# EAGLE design Daughter_ESCON (EAGLE 8.6.0)
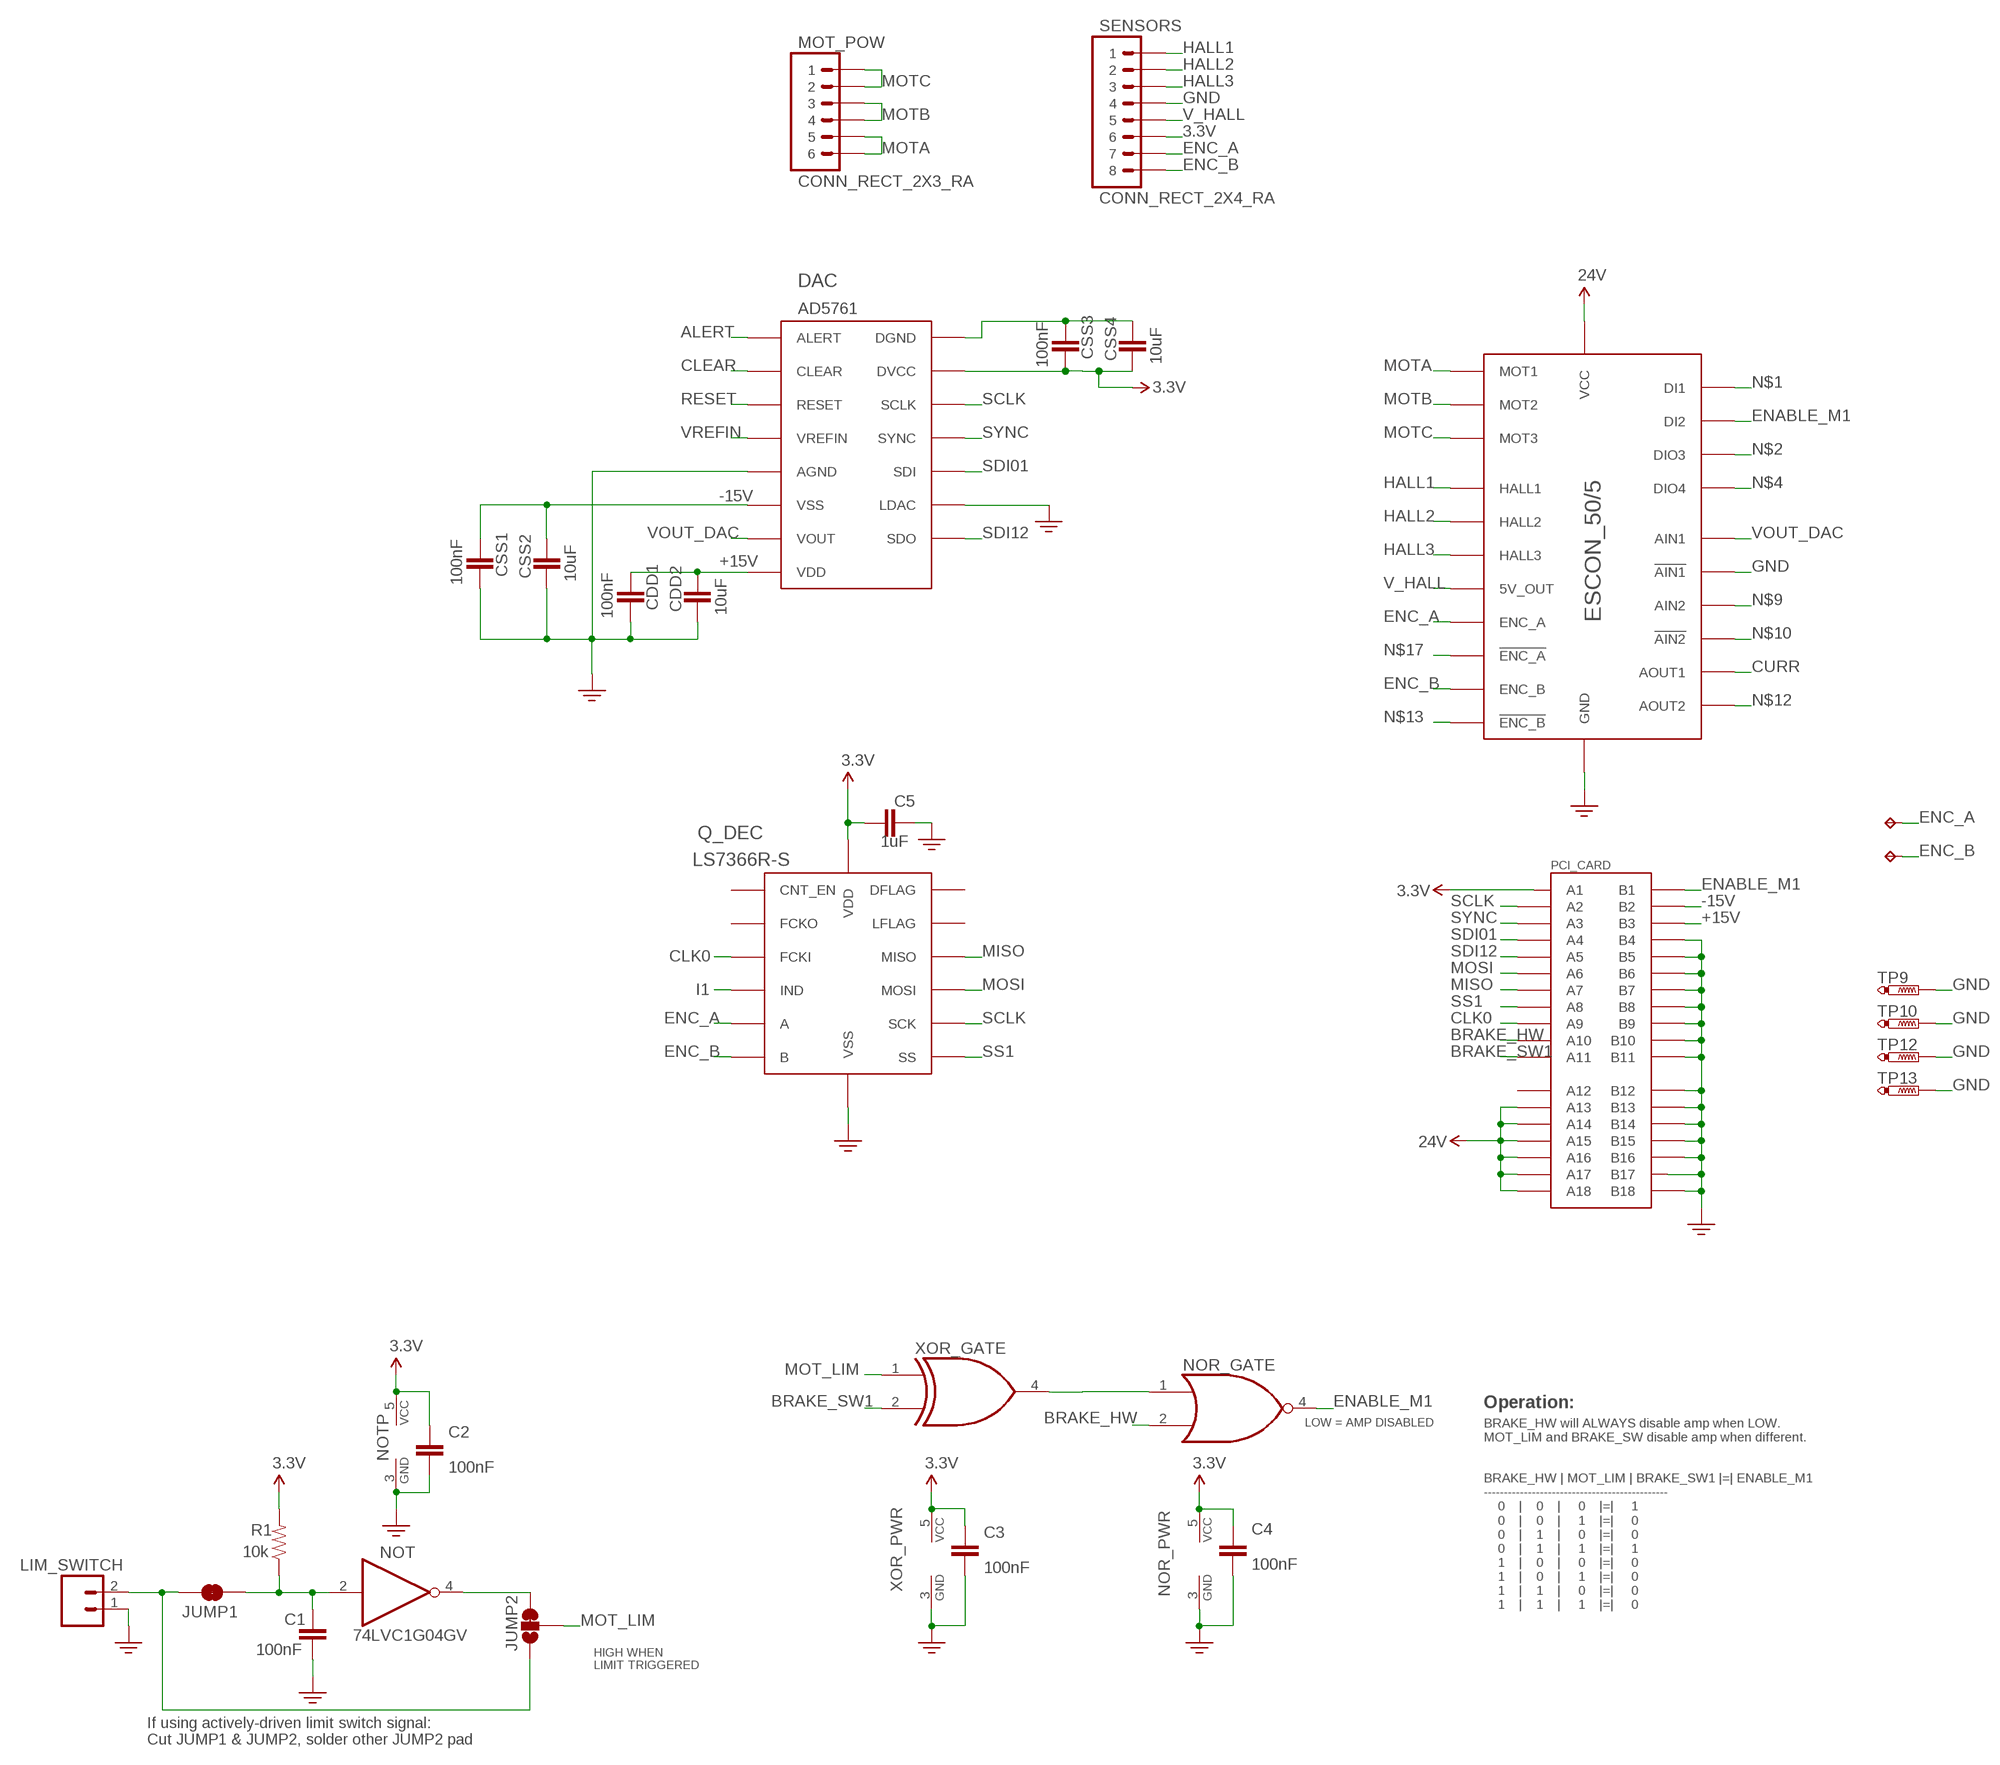
[diagram p0: schematic, sheet 1]

## Parts
A  TEST_POINT_0805  [0805-TP]
B  TEST_POINT_0805  [0805-TP]
C1  100nF  CAP0603-CAP  [0603-CAP]
C2  100nF  CAP0603-CAP  [0603-CAP]
C3  100nF  CAP0603-CAP  [0603-CAP]
C4  100nF  CAP0603-CAP  [0603-CAP]
C5  1uF  CAP0603-CAP  [0603-CAP]
CDD1  100nF  CAP0603-CAP  [0603-CAP]
CDD2  10uF  CAP0805  [C0805K]
CSS1  100nF  CAP0603-CAP  [0603-CAP]
CSS2  10uF  CAP0805  [C0805K]
CSS3  100nF  CAP0603-CAP  [0603-CAP]
CSS4  10uF  CAP0805  [C0805K]
DAC  AD5761  [TSSOP16]
ESCON_50/5  ESCON_50-5  [ESCON_50-5]
JUMP1  JUMPER-PAD-2-NC_BY_TRACE  [PAD-JUMPER-2-NC_BY_TRACE_YES_SILK]
JUMP2  JUMPER-PAD-3-2OF3_NC_BY_TRACE  [PAD-JUMPER-3-2OF3_NC_BY_TRACE_YES_SILK_FULL_BOX]
LIM_SWITCH  22-05-7028-02  [7395-02]
MOT_POW  CONN_RECT_2X3_RA  [2X3-RA]
NOR  NOR-SOT353  [SOT353]
NOT  74LVC1G04GV  74LVC1G04DBV  [SOT23-5]
PCI_CARD  PCIE-36-EDGE  [PCIE-36-EDGE]
Q_DEC  LS7366R-S  [SOIC-14]
R1  10k  RESISTOR-0603  [0603-RES]
SENSORS  CONN_RECT_2X4_RA  [2X4-RA]
TP9  PTR1TP20R  [TP20R]
TP10  PTR1TP20R  [TP20R]
TP12  PTR1TP20R  [TP20R]
TP13  PTR1TP20R  [TP20R]
XOR  XOR-SOT353  [SOT353]

## Nets
3.3V: C2.1 C3.1 C4.1 C5.1 CSS3.2 CSS4.2 DAC.15(DVCC) NOR.5(_PWR:VCC) NOT.5(VCC) PCI_CARD.A1 Q_DEC.14(VDD) R1.2 SENSORS.6 XOR.5(_PWR:VCC)
24V: ESCON_50/5.P$7(VCC) ESCON_50/5.P$8(VCC) PCI_CARD.A13 PCI_CARD.A14 PCI_CARD.A15 PCI_CARD.A16 PCI_CARD.A17 PCI_CARD.A18
+15V: CDD1.1 CDD2.1 DAC.8(VDD) PCI_CARD.B3
-15V: CSS1.1 CSS2.1 DAC.6(VSS) PCI_CARD.B2
ALERT: DAC.1(ALERT)
BRAKE_HW: NOR.2(_GATE:B) PCI_CARD.A10
BRAKE_SW1: PCI_CARD.A11 XOR.2(_GATE:B)
CLEAR: DAC.2(CLEAR)
CLK0: PCI_CARD.A9 Q_DEC.2(FCKI)
CURR: ESCON_50/5.P$25(AOUT1)
ENABLE_M1: ESCON_50/5.P$21(DI2) NOR.4(_GATE:Y) PCI_CARD.B1
ENC_A: A.1(TP) ESCON_50/5.P$12(ENC_A) Q_DEC.12(A) SENSORS.7
ENC_B: B.1(TP) ESCON_50/5.P$16(ENC_B) Q_DEC.11(B) SENSORS.8
GND: C1.2 C2.2 C3.2 C4.2 C5.2 CDD1.2 CDD2.2 CSS1.2 CSS2.2 CSS3.1 CSS4.1 DAC.5(AGND) DAC.11(LDAC) DAC.16(DGND) ESCON_50/5.P$9(GND) ESCON_50/5.P$10(GND) ESCON_50/5.P$23(GND) ESCON_50/5.P$28(!AIN1) LIM_SWITCH.1 NOR.3(_PWR:GND) NOT.3(GND) PCI_CARD.B4 PCI_CARD.B5 PCI_CARD.B6 PCI_CARD.B7 PCI_CARD.B8 PCI_CARD.B9 PCI_CARD.B10 PCI_CARD.B11 PCI_CARD.B12 PCI_CARD.B13 PCI_CARD.B14 PCI_CARD.B15 PCI_CARD.B16 PCI_CARD.B17 PCI_CARD.B18 Q_DEC.3(VSS) SENSORS.4 TP9.TP TP10.TP TP12.TP TP13.TP XOR.3(_PWR:GND) ; supply symbol labelled GND2
HALL1: ESCON_50/5.P$13(HALL1) SENSORS.1
HALL2: ESCON_50/5.P$15(HALL2) SENSORS.2
HALL3: ESCON_50/5.P$17(HALL3) SENSORS.3
I1: Q_DEC.10(IND)
MISO: PCI_CARD.A7 Q_DEC.6(MISO)
MOSI: PCI_CARD.A6 Q_DEC.7(MOSI)
MOT_LIM: JUMP2.2 XOR.1(_GATE:A)
MOTA: ESCON_50/5.P$1(MOT1) ESCON_50/5.P$2(MOT1) MOT_POW.5 MOT_POW.6
MOTB: ESCON_50/5.P$3(MOT2) ESCON_50/5.P$4(MOT2) MOT_POW.3 MOT_POW.4
MOTC: ESCON_50/5.P$5(MOT3) ESCON_50/5.P$6(MOT3) MOT_POW.1 MOT_POW.2
N$1: ESCON_50/5.P$22(DI1)
N$2: ESCON_50/5.P$20(DIO3)
N$3: JUMP1.1 JUMP2.1 LIM_SWITCH.2
N$4: ESCON_50/5.P$19(DIO4)
N$5: C1.1 JUMP1.2 NOT.2(I) R1.1
N$6: JUMP2.3 NOT.4(O)
N$9: ESCON_50/5.P$27(AIN2)
N$10: ESCON_50/5.P$26(!AIN2)
N$12: ESCON_50/5.P$24(AOUT2)
N$13: ESCON_50/5.P$18(!ENC_B)
N$14: NOR.1(_GATE:A) XOR.4(_GATE:Y)
N$17: ESCON_50/5.P$14(!ENC_A)
RESET: DAC.3(RESET)
SCLK: DAC.14(SCLK) PCI_CARD.A2 Q_DEC.5(SCK)
SDI01: DAC.12(SDI) PCI_CARD.A4
SDI12: DAC.10(SDO) PCI_CARD.A5
SS1: PCI_CARD.A8 Q_DEC.4(SS)
SYNC: DAC.13(SYNC) PCI_CARD.A3
V_HALL: ESCON_50/5.P$11(5V_OUT) SENSORS.5
VOUT_DAC: DAC.7(VOUT) ESCON_50/5.P$29(AIN1)
VREFIN: DAC.4(VREFIN)
Unconnected: PCI_CARD.A12 Q_DEC.1(FCKO) Q_DEC.8(LFLAG) Q_DEC.9(DFLAG) Q_DEC.13(CNT_EN)

## Notes on the sheet
- Operation:
- LOW = AMP DISABLED
- BRAKE_HW will ALWAYS disable amp when LOW.
  MOT_LIM and BRAKE_SW disable amp when different.
- BRAKE_HW | MOT_LIM | BRAKE_SW1 |=| ENABLE_M1
  ----------------------------------------------
      0    |    0    |     0    |=|     1
      0    |    0    |     1    |=|     0
      0    |    1    |     0    |=|     0
      0    |    1    |     1    |=|     1
      1    |    0    |     0    |=|     0
      1    |    0    |     1    |=|     0
      1    |    1    |     0    |=|     0
      1    |    1    |     1    |=|     0
- HIGH WHEN
  LIMIT TRIGGERED
- If using actively-driven limit switch signal:
  Cut JUMP1 & JUMP2, solder other JUMP2 pad

## Library data of the parts
A B = Cannula_1_0:TEST_POINT
C1-C5 CDD1 CSS1 CSS3 = SparkFun-Capacitors:CAP: Capacitor Standard 0603 ceramic capacitor, and 0.1" leaded capacitor.
CDD2 CSS2 CSS4 = Cannula_1_0:CAP0805
DAC = Cannula_1_0:AD5761: AD5761R Multiple Range, 16-bit, Bipolar/Unipolar Voltage Output DAC datasheet <http://www.analog.com/media/en/technical-documentation/data-sheets/AD5761R_5721R.pdf> Trevor Bruns- 2015
ESCON_50/5 = Cannula_1_0:ESCON_50-5
JUMP1 = SparkFun-Passives:JUMPER-PAD-2-NC_BY_TRACE
JUMP2 = SparkFun-Passives:JUMPER-PAD-3-2OF3_NC_BY_TRACE
LIM_SWITCH = Cannula_1_0:22-?-02: CONNECTOR wire to board 2.54 mm (.1 inch) pitch header; OC_FARNELL: 9731601; OC_NEWARK: unknown
MOT_POW = Cannula_1_0:CONN_RECT_2X3
NOR = Cannula_1_0:NOR: Single 2-Input NOR Gate Digikey: 74AHC1G02SE-7DICT-ND Datasheet <http://www.diodes.com/datasheets/74AHC1G02.pdf> Trevor Bruns 6/1/2015
NOT = 74xx-little-us:74*1G04: INVERTER Gate
PCI_CARD = Cannula_1_0:PCIE-36-*: PCI-E 36-way connectors
Q_DEC = Cannula_1_0:LS7366R: LS7366R 32-Bit Quadrature Counter with SPI datasheet <http://www.lsicsi.com/pdfs/Data_Sheets/LS7366R.pdf> Trevor Bruns- 2015
R1 = Cannula_1_0:RESISTOR
SENSORS = Cannula_1_0:CONN_RECT_2X4
TP9 TP10 TP12 TP13 = testpad:PTR1: TEST PIN
XOR = Cannula_1_0:XOR

## Board
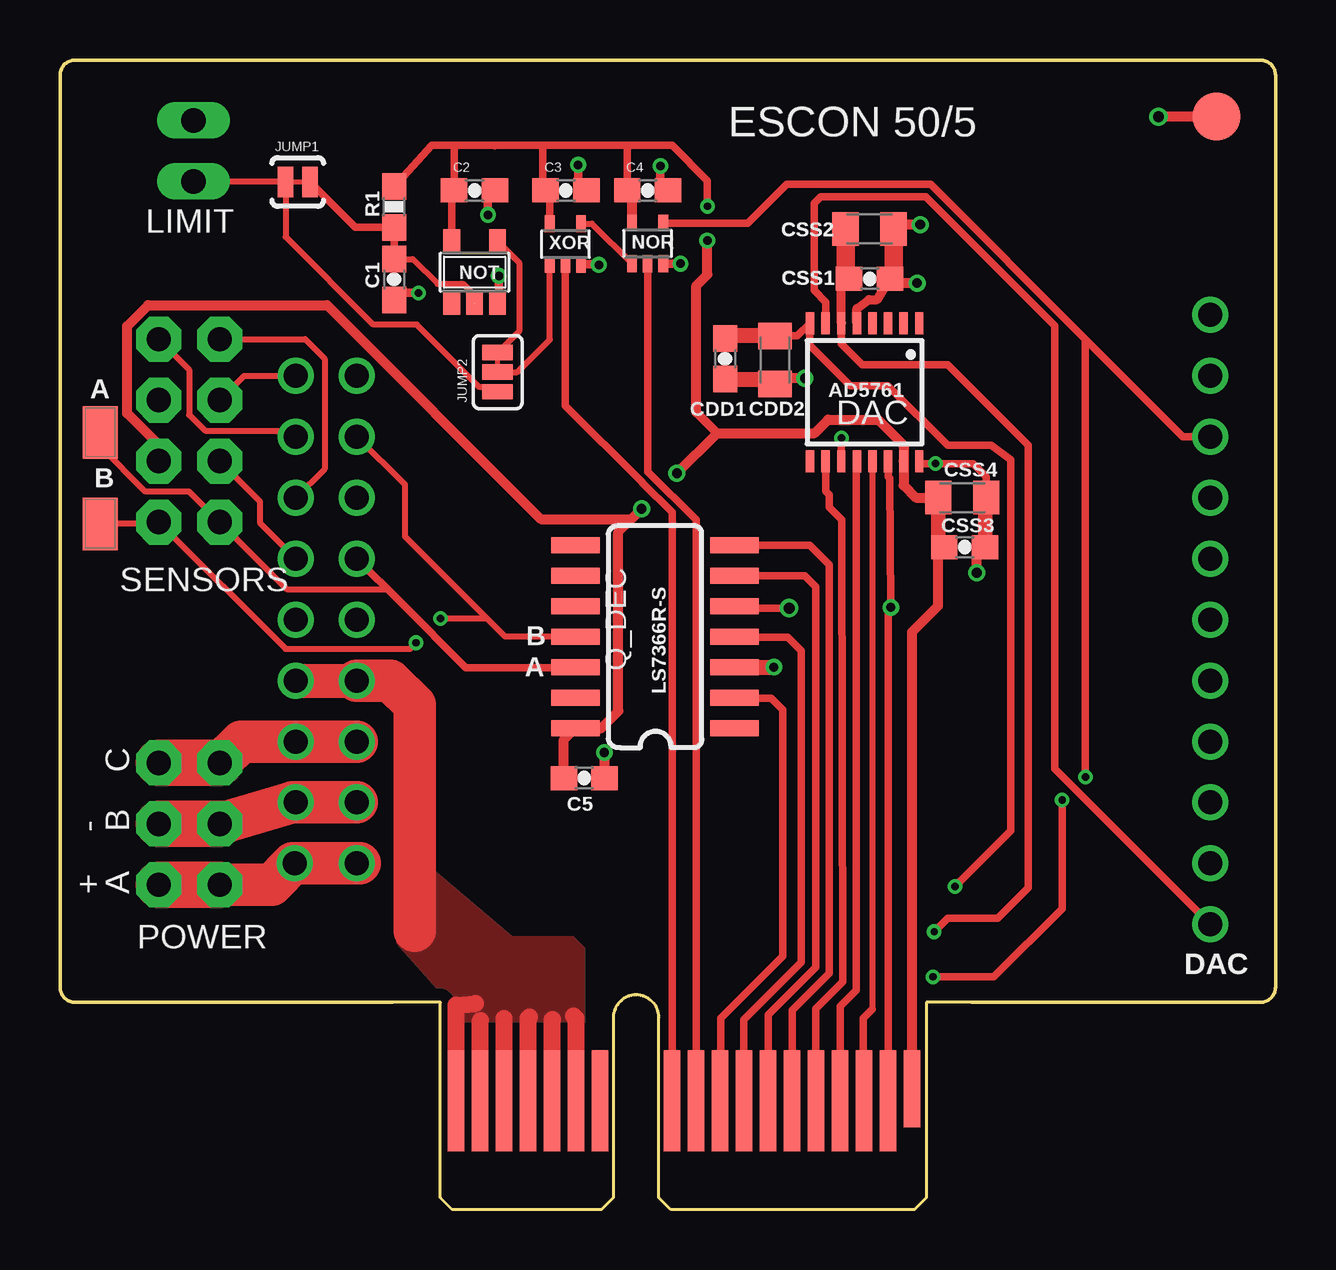
[diagram p1: board, top side]
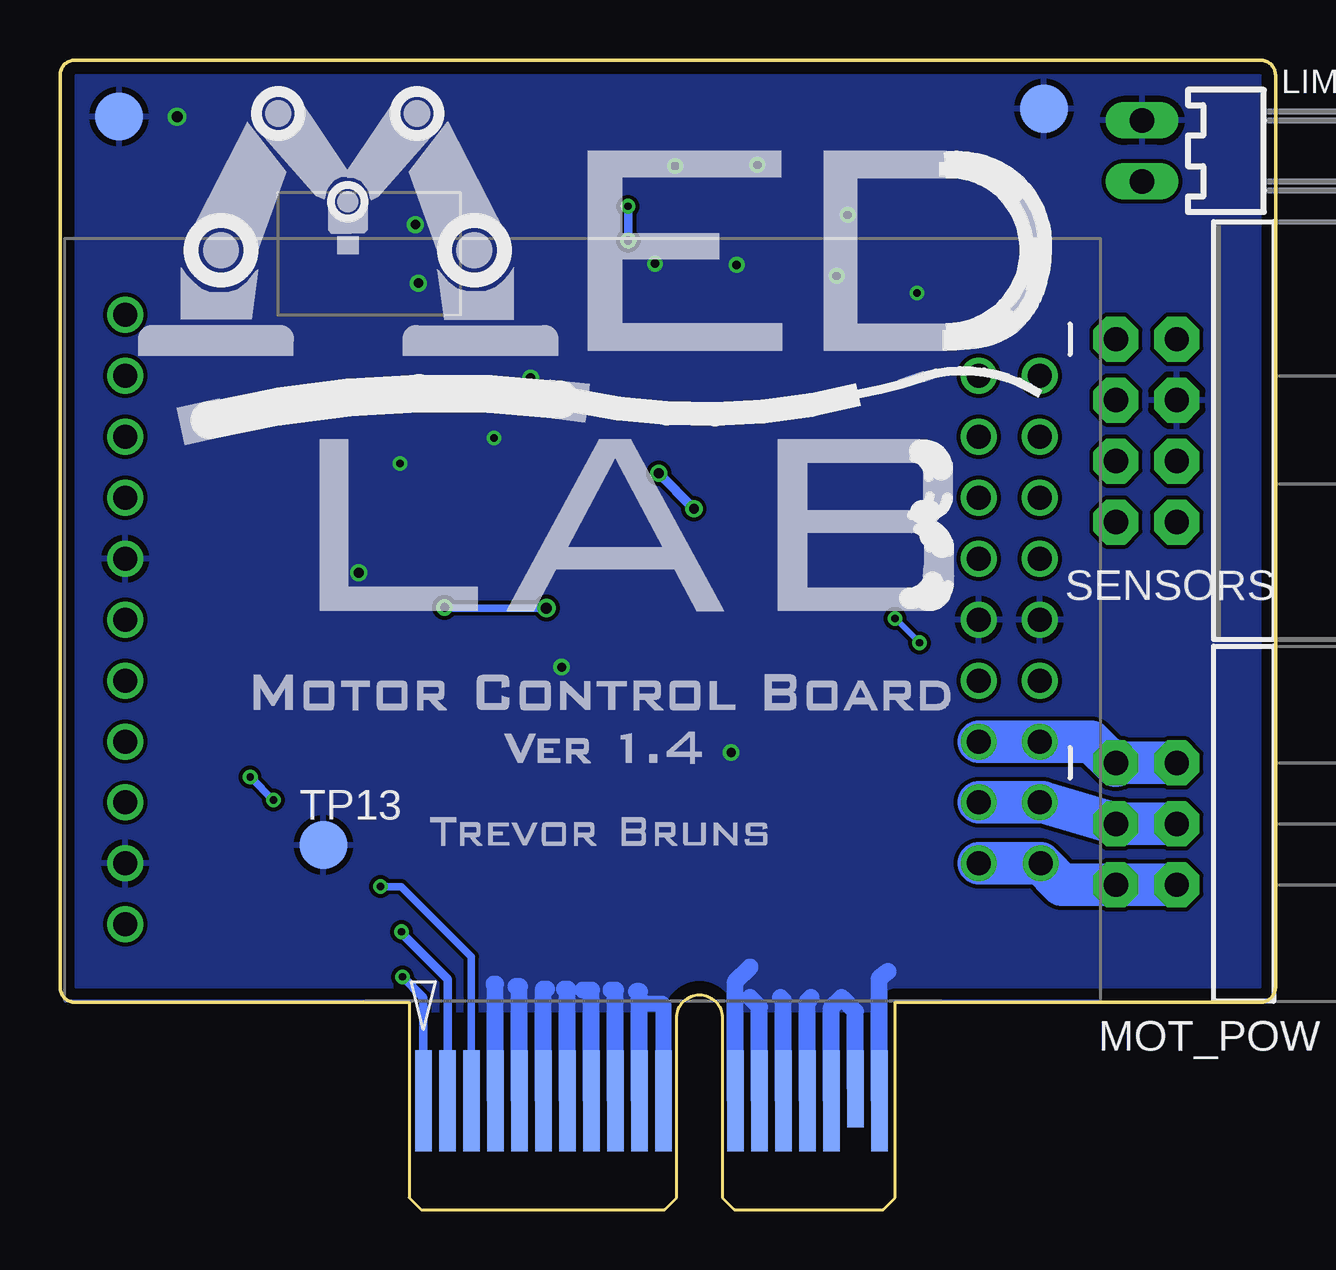
[diagram p2: board, bottom side, seen from below]

Size 50.65 x 47.9 mm. Coordinates in mm from the lower left corner, seen from the top.
Outline: 13.87,8.64 0.63,8.64 arc-90 0,9.27 0,47.27 arc-90 0.63,47.9 50.01,47.9 arc-90 50.65,47.27 50.65,9.27 arc-90 50.01,8.64 38,8.64
Copper layers (1*16): Top 0.035mm / dielectric 1.5mm / Bottom 0.035mm
Design rules "PCBWay_2018-01-18": minimum track width 6mil, minimum drill 12mil, track to track 6.5mil, track to pad 6.5mil, pad to pad 6.5mil, via to via 6.5mil, smd to smd 6mil, copper to edge 20mil, drill to drill 8mil, minimum pad ring 6mil, minimum via ring 6mil, stop-mask expansion 4mil, vias tented up to drill 0mil, thermal gap 10mil

### Footprints (pad centres in the part's own frame; a part is rotated, then mirrored left to right if it is on the bottom)
0805-TP = smd 2.2 x 1.45: 1 0,0
0603-CAP = smd 1.1 x 1: 1 -0.85,0; 2 0.85,0
C0805K = smd 1.1 x 1.4: 1 -1,0; 2 1,0
TSSOP16 = smd 0.9 x 0.35: 1 -2.875,2.275; 2 -2.875,1.625; 3 -2.875,0.975; 4 -2.875,0.325; 5 -2.875,-0.325; 6 -2.875,-0.975; 7 -2.875,-1.625; 8 -2.875,-2.275; 9 2.875,-2.275; 10 2.875,-1.625; 11 2.875,-0.975; 12 2.875,-0.325; 13 2.875,0.325; 14 2.875,0.975; 15 2.875,1.625; 16 2.875,2.275
ESCON_50-5 = drill 1: P$1 -19.09,10.16; P$2 -16.51,10.16; P$3 -19.05,7.62; P$4 -16.51,7.62; P$5 -19.05,5.08; P$6 -16.51,5.08; P$7 -19.05,2.54; P$8 -16.51,2.54; P$9 -19.05,0; P$10 -16.51,0; P$11 -19.05,-2.54; P$12 -16.51,-2.54; P$13 -19.05,-5.08; P$14 -16.51,-5.08; P$15 -19.05,-7.62; P$16 -16.51,-7.62; P$17 -19.05,-10.16; P$18 -16.51,-10.16; P$19 19.05,-12.7; P$20 19.05,-10.16; P$21 19.05,-7.62; P$22 19.05,-5.08; P$23 19.05,-2.54; P$24 19.05,0; P$25 19.05,2.54; P$26 19.05,5.08; P$27 19.05,7.62; P$28 19.05,10.16; P$29 19.05,12.7
PAD-JUMPER-2-NC_BY_TRACE_YES_SILK = smd 0.635 x 1.27: 1 -0.508,0; 2 0.508,0
PAD-JUMPER-3-2OF3_NC_BY_TRACE_YES_SILK_FULL_BOX = smd 0.635 x 1.27: 1 -0.813,0; 2 0,0; 3 0.813,0
7395-02 = drill 1.016 long: 1 1.27,0; 2 -1.27,0
2X3-RA = drill 1.016 pad 1.88 octagon: 1 -1.27,2.54; 2 1.27,2.54; 3 -1.27,0; 4 1.27,0; 5 -1.27,-2.54; 6 1.27,-2.54
SOT353 = smd 0.4 x 0.7: 1 -0.65,-0.85; 2 0,-0.85; 3 0.65,-0.85; 4 0.65,0.85; 5 -0.65,0.85
SOT23-5 = smd 0.69 x 0.99: 1 -0.95,-1.29; 2 0,-1.29; 3 0.95,-1.29; 4 0.95,1.3; 5 -0.95,1.3
PCIE-36-EDGE = smd 0.7 x 3.2 bottom: A1 -11.5,-3.6 | smd 0.7 x 4.2 bottom: A2 -10.5,-4.1; A3 -9.5,-4.1; A4 -8.5,-4.1; A5 -7.5,-4.1; A6 -6.5,-4.1; A7 -5.5,-4.1; A8 -4.5,-4.1; A9 -3.5,-4.1; A10 -2.5,-4.1; A11 -1.5,-4.1; A12 1.5,-4.1; A13 2.5,-4.1; A14 3.5,-4.1; A15 4.5,-4.1; A16 5.5,-4.1; A17 6.5,-4.1; A18 7.5,-4.1 | smd 0.7 x 4.2: B1 -11.5,-4.1; B2 -10.5,-4.1; B3 -9.5,-4.1; B4 -8.5,-4.1; B5 -7.5,-4.1; B6 -6.5,-4.1; B7 -5.5,-4.1; B8 -4.5,-4.1; B9 -3.5,-4.1; B10 -2.5,-4.1; B11 -1.5,-4.1; B12 1.5,-4.1; B13 2.5,-4.1; B14 3.5,-4.1; B15 4.5,-4.1; B16 5.5,-4.1; B18 7.5,-4.1 | smd 0.7 x 3.2: B17 6.5,-3.6
SOIC-14 = smd 0.66 x 2.032: 1 -4.445,-3.315; 2 -3.175,-3.315; 3 -1.905,-3.315; 4 -0.635,-3.315; 5 0.635,-3.315; 6 1.905,-3.315; 7 3.175,-3.315; 8 3.175,3.315; 9 1.905,3.315; 10 0.635,3.315; 11 -0.635,3.315; 12 -1.905,3.315; 13 -3.175,3.315; 14 -4.445,3.315
0603-RES = smd 1.1 x 1: 1 -0.85,0; 2 0.85,0
2X4-RA = drill 1.016 pad 1.88 octagon: 1 -1.27,3.81; 2 1.27,3.81; 3 -1.27,1.27; 4 1.27,1.27; 5 -1.27,-1.27; 6 1.27,-1.27; 7 -1.27,-3.81; 8 1.27,-3.81
TP20R = smd 2 x 2: TP 0,0

### Placement (x,y rotation side)
A  1.68,32.38 90 top
B  1.68,28.57 90 top
C1  13.92,38.76 270 top
C2  17.27,42.47 0 top
C3  21.08,42.47 0 top
C4  24.49,42.47 0 top
C5  21.84,17.98 0 top
CDD1  27.71,35.46 270 top
CDD2  29.79,35.41 270 top
CSS1  33.73,38.78 0 top
CSS2  33.73,40.87 0 top
CSS3  37.69,27.61 180 top
CSS4  37.59,29.67 180 top
DAC  33.53,34.06 270 top
ESCON_50/5  28.88,24.59 180 bottom
JUMP1  9.91,42.82 0 top
JUMP2  18.24,34.9 90 top
LIM_SWITCH  5.56,44.12 90 bottom
MOT_POW  5.38,16.08 0 bottom
NOR  24.49,40.26 0 top
NOT  17.27,39.06 0 top
PCI_CARD  24,8.63 0 bottom
Q_DEC  24.79,24.51 90 top
R1  13.92,41.78 90 top
SENSORS  5.38,32.46 0 bottom
TP9  9.65,45.87 0 bottom
TP10  48.18,45.54 0 top
TP12  48.18,45.54 0 bottom
TP13  39.67,15.19 0 bottom
U$2  [LOGO_MOTOR_CONTROL_1.4_SMALL]  27.79,18.95 0 bottom
U$6  LOGO_MEDLAB_1.5X0.86  [LOGO_MEDLAB_1.5X0.86]  27.38,34.49 0 bottom
XOR  21.06,40.23 0 top

### Tracks (layer width: path | path; a pad name or v marks a point on that pad's centre or on a via)
3.3V  (via drill 0.3, 0.36, 0.41)
  Top 0.305: XOR.5 20.41,42.29 C3.1 20.12,42.58 20.12,44.35 | 23.62,44.35 20.12,44.35 | C4.1 23.64,44.33 23.62,44.35 | 20.12,44.35 18.14,44.35 | 18.14,44.35 16.41,44.35 | 16.41,44.35 15.48,44.35 R1.2 | 18.12,44.33 18.14,44.35 | 16.41,44.35 16.42,44.33 C2.1 16.32,42.37 NOT.5 | 23.62,44.35 25.5,44.35 26.97,42.87 v26.97,41.81
  Top 0.356: 27.38,32.36 26.52,33.22
  Top 0.406: 23.8,28.78 23.27,28.24 23.27,20.78 22.55,20.07 Q_DEC.14 20.99,19.58 C5.1 | 23.8,28.78 v24.23,29.21 | v25.7,30.68 27.38,32.36 31.44,32.36 32,32.92 34.09,32.92 35.15,31.85 DAC.15 35.15,30.18 35.66,29.67 CSS4.2 | NOR.5 23.84,42.27 C4.1 | PCI_CARD.A1 35.5,24.07 36.59,25.16 36.59,27.86 | SENSORS.6 4.11,31.86 2.79,33.18 2.79,36.82 3.67,37.69 11.12,37.69 20.04,28.78 23.8,28.78 | 26.52,33.22 26.52,38.51 26.97,38.96 v26.97,40.39
  Top 0.61: CSS4.2 36.59,27.86 CSS3.2
  Bottom 0.356: v26.97,41.81 v26.97,40.39
  Bottom 0.406: v24.23,29.21 v25.7,30.68
24V
  Top 0.699: PCI_CARD.A13 21.5,7.96 21.39,8.08 | PCI_CARD.A14 20.5,7.9 20.52,7.92 | PCI_CARD.A15 19.5,7.97 19.56,8.03 | PCI_CARD.A16 18.5,7.96 18.49,7.97 | PCI_CARD.A18 16.5,8.53 17.32,8.58 | PCI_CARD.A17 17.5,7.85 17.53,7.87
  Top 1.422: ESCON_50/5.P$7 ESCON_50/5.P$8
  Top 1.778: ESCON_50/5.P$8 13.77,22.05 14.78,21.03 14.78,11.63
  pour Top (no thermals): 16.05,7.82 21.89,7.82 21.89,10.87 21.39,11.38 18.85,11.38 15.54,14.17 14.02,14.17 14.02,11.12 16.05,8.84
+15V  (via drill 0.3)
  Top 0.305: v37.29,13.46 39.62,15.8 39.62,31.24 38.81,31.85 36.98,31.85 34.49,34.34 32.92,34.34 31.24,36.02 31.24,36.92 DAC.8 30.72,36.41 CDD2.1
  Top 0.635: CDD2.1 27.81,36.41 CDD1.1
  Bottom 0.305: PCI_CARD.B3 33.5,10.54 36.42,13.46 v37.29,13.46
-15V  (via drill 0.3)
  Top 0.305: DAC.6 32.55,36.08 33.43,35.2 36.98,35.2 40.33,31.85 40.33,13.41 39.06,12.14 36.98,12.14 v36.42,11.58
  Top 0.381: DAC.6 32.55,38.46
  Top 0.508: 32.55,38.46 CSS1.1
  Top 0.699: 32.77,40.85 CSS2.1
  Top 0.762: CSS2.1 32.73,38.94 CSS1.1
  Bottom 0.356: 34.49,4.55 34.49,9.6 36.42,11.53 v36.42,11.58
  Bottom 0.699: 34.49,4.55 PCI_CARD.B2
BRAKE_HW
  Top 0.305: PCI_CARD.A10 26.5,28.74 24.49,30.76 NOR.2
BRAKE_SW1
  Top 0.305: PCI_CARD.A11 25.5,29.06 24.28,30.28 24.23,30.33 21.06,33.5 XOR.2
CLK0
  Top 0.254: Q_DEC.2 28.13,21.31
  Top 0.305: PCI_CARD.A9 27.53,4.57 27.53,7.97 30.12,10.57 30.12,20.83 29.64,21.31 28.13,21.31
ENABLE_M1  (via drill 0.3)
  Top 0.305: 42.72,36.27 v42.72,18.03 | ESCON_50/5.P$21 46.79,32.21 42.72,36.27 | v41.76,17.07 41.76,12.55 38.91,9.7 v36.37,9.7 | 42.72,36.27 36.27,42.72 30.28,42.72 28.66,41.11 NOR.4
  Bottom 0.305: v42.72,18.03 v41.76,17.07
  Bottom 0.356: v36.37,9.7 35.5,8.83 PCI_CARD.B1
ENC_A
  Top 0.254: 14.21,25.29 13.64,25.86 9.45,25.86 SENSORS.7 5.38,29.92 3.56,29.92 1.68,31.8 A.1
  Top 0.305: Q_DEC.12 21.45,22.58 16.92,22.58 14.21,25.29 ESCON_50/5.P$12
ENC_B  (via drill 0.3)
  Top 0.254: Q_DEC.11 18.54,23.88 17.78,24.64 | 17.78,24.64 14.38,28.04 14.38,30.2 ESCON_50/5.P$16 | v14.83,23.62 14.58,23.37 9.4,23.37 SENSORS.8 4.04,28.57 B.1 | v15.85,24.64 17.78,24.64
  Bottom 0.254: v14.83,23.62 v15.85,24.64
GND  (via drill 0.3, 0.36, 0.38, 0.41, 0.46)
  Top 0.305: CSS4.1 38.59,30.55 38.05,31.09 v36.47,31.09 35.9,31.09 DAC.16 | DAC.11 32.55,32.15 v32.56,32.16
  Top 0.356: v14.93,38.2 14.06,38.2 C1.2 | v25.02,43.48 25.02,42.78 C4.2 | v21.59,43.53 21.59,42.81 C3.2 | XOR.3 22.44,39.38 v22.45,39.37 | NOR.3 v25.86,39.42 | v17.83,41.45 17.83,42.18 C2.2 | v18.29,38.91 18.29,37.85 NOT.3
  Top 0.381: DAC.5 33.2,37.55 33.71,37.92 34.05,37.92 CSS1.2
  Top 0.406: TP12.TP v45.77,45.54 | v22.68,19.05 22.68,17.97 C5.2 | v35.84,41.05 34.91,41.05 CSS2.2 | v35.71,38.61 34.76,38.61 CSS1.2 | v31.04,34.64 30.03,34.64 CDD2.2 | v38.2,26.54 38.2,27.27 38.59,27.66
  Top 0.61: CSS3.1 38.54,29.62 CSS4.1
  Top 0.635: CDD1.2 29.59,34.61 CDD2.2 | Q_DEC.3 v29.74,22.61
  Top 0.699: 38.59,27.66 CSS3.1
  Top 0.762: 34.73,39.67 CSS2.2 34.73,38.94 CSS1.2 34.58,38.71 | CDD1.2 27.71,34.54
  Bottom 0.66: PCI_CARD.B11 25.5,8.51 25.58,8.58 26.5,8.58
  Bottom 0.699: PCI_CARD.B12 22.5,9.5 21.89,10.11 | PCI_CARD.B13 21.5,8.45 21.89,8.84 | PCI_CARD.B14 20.5,8.72 20.62,8.84 | PCI_CARD.B15 19.5,8.69 19.35,8.84 | PCI_CARD.B16 18.5,8.42 18.08,8.84 17.5,8.26 PCI_CARD.B17 | PCI_CARD.B18 16.5,9.66 16.15,9.93 | PCI_CARD.B4 32.5,9.4 32.56,9.4 | PCI_CARD.B5 31.5,9.3 31.65,9.3 | PCI_CARD.B6 30.5,9.19 30.38,9.19 | PCI_CARD.B7 29.5,9.19 29.62,9.19 | PCI_CARD.B8 28.5,9.14 28.85,9.14 | PCI_CARD.B9 27.5,9.14 27.69,9.14 | PCI_CARD.B10 26.5,8.58 26.5,9.09 26.62,9.09
  pour Bottom (rank 2): 52.37,49.48 -0.97,49.48 -0.41,8.33 52.58,8.33
HALL1
  Top 0.254: SENSORS.1 10.21,36.27 11.02,35.46 11.02,30.86 ESCON_50/5.P$13
HALL2
  Top 0.254: SENSORS.2 5.38,35 5.38,33.12 6.04,32.46 9.58,32.46 ESCON_50/5.P$15
HALL3
  Top 0.254: SENSORS.3 7.67,34.75 ESCON_50/5.P$17
MISO
  Top 0.305: PCI_CARD.A7 29.51,4.55 29.51,8.13 31.5,10.11 31.5,25.96 31.04,26.42 Q_DEC.6
MOSI
  Top 0.305: Q_DEC.7 31.24,27.69 32.05,26.87 32.05,9.85 30.5,8.3 PCI_CARD.A6
MOT_LIM
  Top 0.254: XOR.1 20.41,36.26 19.05,34.9 JUMP2.2
MOTA
  Top 1.778: MOT_POW.5 8.81,13.54 9.7,14.43 12.5,14.43
  Top 1.93: MOT_POW.6 MOT_POW.5
  Bottom 1.778: MOT_POW.6 MOT_POW.5 8.9,13.54 ESCON_50/5.P$1 ESCON_50/5.P$2
MOTB
  Top 1.778: ESCON_50/5.P$4 9.7,16.97 MOT_POW.3
  Top 1.93: MOT_POW.3 MOT_POW.4
  Bottom 1.778: MOT_POW.4 MOT_POW.3 9.7,16.97 | ESCON_50/5.P$4 ESCON_50/5.P$3
MOTC
  Top 1.778: ESCON_50/5.P$6 7.54,19.51 MOT_POW.1
  Top 1.93: MOT_POW.2 MOT_POW.1
  Bottom 1.778: MOT_POW.2 MOT_POW.1 | ESCON_50/5.P$6 ESCON_50/5.P$5 7.67,19.51 6.65,18.49
N$3
  Top 0.254: JUMP2.1 18.05,34.28 17.48,34.28 14.87,36.88 13.06,36.88 9.4,40.54 JUMP1.1 5.59,42.82 LIM_SWITCH.2
N$5
  Top 0.254: C1.1 14.69,39.61 15.73,38.57 16.79,38.57 17.27,38.1 NOT.2
  Top 0.305: JUMP1.2 12.31,40.93 R1.1 C1.1
N$6
  Top 0.254: NOT.4 19.15,39.43 19.15,36.63 JUMP2.3
N$14
  Top 0.254: XOR.4 22.16,41.08 NOR.1
SCLK  (via drill 0.38, 0.46)
  Top 0.305: PCI_CARD.A2 34.5,25.08 34.56,25.08 v34.62,25.09 34.57,30.48 34.52,30.53 34.52,31.17 DAC.14 | v30.38,25.07 28.18,25.07 Q_DEC.5
  Bottom 0.305: v30.38,25.07 34.54,25.07 v34.62,25.09
SDI01
  Top 0.305: DAC.12 33.17,31.16 33.17,9.14 32.5,8.47 PCI_CARD.A4
SDI12
  Top 0.305: PCI_CARD.A5 31.5,4.54 31.5,8.38 32.61,9.5 32.56,28.75 32.05,29.26 32.05,29.79 31.9,29.95 DAC.10
SS1
  Top 0.305: PCI_CARD.A8 28.5,7.92 30.89,10.31 30.89,23.29 30.33,23.85 28.13,23.85 Q_DEC.4
SYNC
  Top 0.254: DAC.13 33.85,8.35
  Top 0.305: 33.85,8.35 33.48,7.97 33.48,4.56 PCI_CARD.A3
V_HALL
  Top 0.254: SENSORS.5 8.33,29.51 8.33,28.63 ESCON_50/5.P$11
VOUT_DAC
  Top 0.305: DAC.7 31.9,37.82 31.42,38.3 31.42,41.93 31.7,42.21 36.07,42.21 41.45,36.83 41.45,18.36 ESCON_50/5.P$29

### Text on the board
tPlace: ESCON 50/5 | LIMIT | SENSORS | B | A | C | - | B | + | A | POWER | DAC
_tPlace: CSS2 | CSS1
_tNames: DAC | Q_DEC
_bNames: MOT_LIM | SENSORS | TP13 | MOT_POW